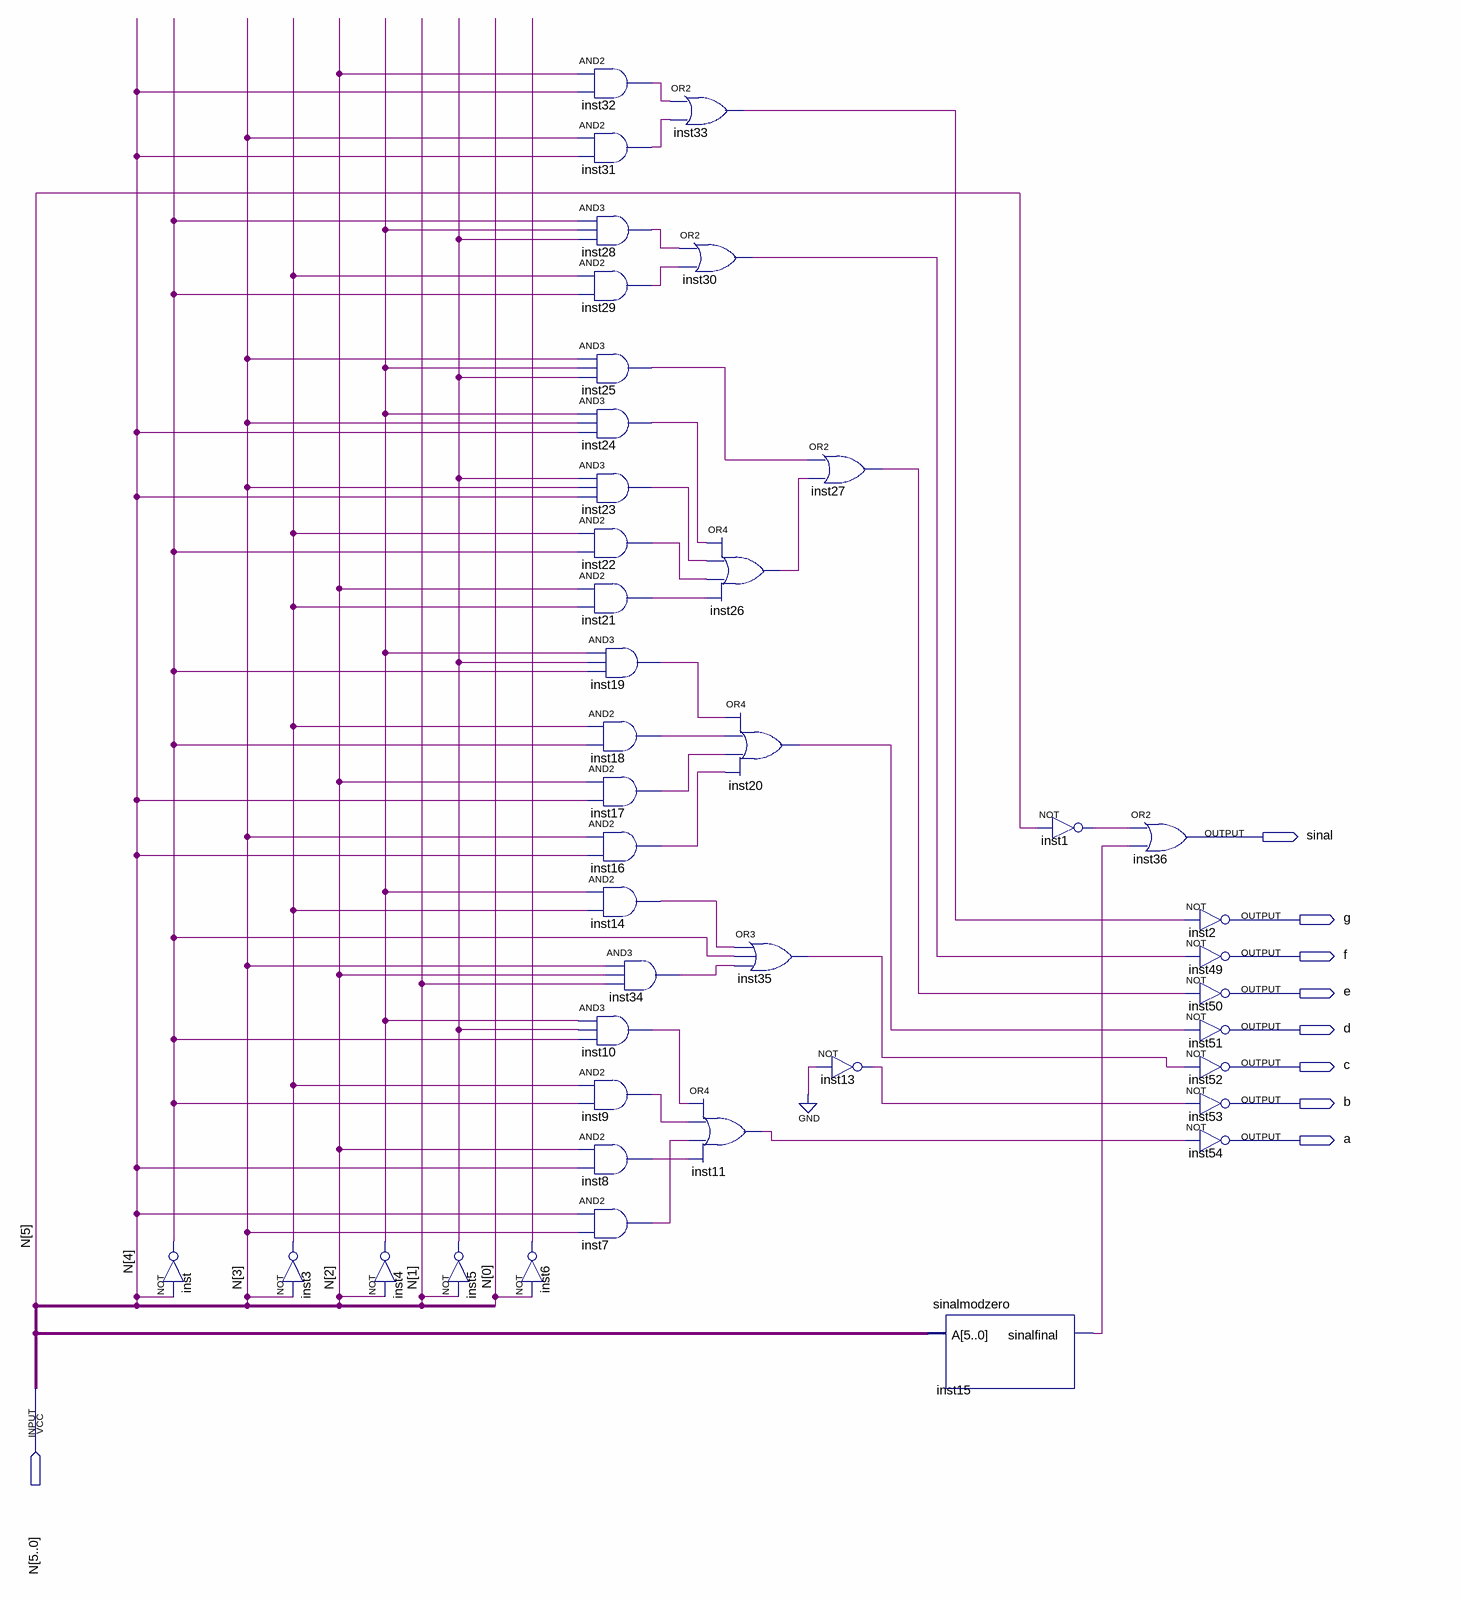
[diagram p0: schematic sheet]
// Quartus schematic dezena.bdf as structural Verilog: 42 symbols, 9 pins
module dezena (
  input  [5:0] N,
  output sinal,
  output g,
  output f,
  output e,
  output d,
  output c,
  output b,
  output a
);

  wire inst1_out, inst3_out, inst4_out, inst5_out, inst6_out, inst7_out, inst8_out, inst9_out, inst10_out,
       inst11_out, inst13_out, inst14_out, inst15_sinalfinal, inst16_out, inst17_out, inst18_out, inst19_out,
       inst20_out, inst21_out, inst22_out, inst23_out, inst24_out, inst25_out, inst26_out, inst27_out,
       inst28_out, inst29_out, inst30_out, inst31_out, inst32_out, inst33_out, inst34_out, inst35_out,
       inst_out;

  not inst (inst_out, N[4]);
  not inst3 (inst3_out, N[3]);
  not inst4 (inst4_out, N[2]);
  not inst5 (inst5_out, N[1]);
  not inst6 (inst6_out, N[0]);
  and inst32 (inst32_out, N[2], N[4]);
  and inst31 (inst31_out, N[3], N[4]);
  and inst28 (inst28_out, inst_out, inst4_out, inst5_out);
  and inst29 (inst29_out, inst3_out, inst_out);
  and inst25 (inst25_out, N[3], inst4_out, inst5_out);
  and inst24 (inst24_out, inst4_out, N[3], N[4]);
  and inst23 (inst23_out, inst5_out, N[3], N[4]);
  and inst22 (inst22_out, inst3_out, inst_out);
  and inst21 (inst21_out, N[2], inst3_out);
  and inst19 (inst19_out, inst4_out, inst5_out, inst_out);
  and inst18 (inst18_out, inst3_out, inst_out);
  and inst17 (inst17_out, N[2], N[4]);
  and inst16 (inst16_out, N[3], N[4]);
  and inst14 (inst14_out, inst4_out, inst3_out);
  and inst34 (inst34_out, N[3], N[2], N[1]);
  and inst10 (inst10_out, inst4_out, inst5_out, inst_out);
  and inst9 (inst9_out, inst3_out, inst_out);
  and inst8 (inst8_out, N[2], N[4]);
  and inst7 (inst7_out, N[4], N[3]);
  or inst33 (inst33_out, inst32_out, inst31_out);
  or inst30 (inst30_out, inst28_out, inst29_out);
  or inst11 (inst11_out, inst10_out, inst9_out, inst7_out, inst8_out);
  or inst26 (inst26_out, inst24_out, inst23_out, inst22_out, inst21_out);
  or inst20 (inst20_out, inst19_out, inst18_out, inst17_out, inst16_out);
  or inst35 (inst35_out, inst14_out, inst_out, inst34_out);
  or inst27 (inst27_out, inst25_out, inst26_out);
  not inst13 (inst13_out, 1'b0);
  sinalmodzero inst15 (.A(N), .sinalfinal(inst15_sinalfinal));
  not inst1 (inst1_out, N[5]);
  or inst36 (sinal, inst1_out, inst15_sinalfinal);
  not inst2 (g, inst33_out);
  not inst49 (f, inst30_out);
  not inst50 (e, inst27_out);
  not inst51 (d, inst20_out);
  not inst52 (c, inst35_out);
  not inst53 (b, inst13_out);
  not inst54 (a, inst11_out);
endmodule
